# EAGLE design Pressure (EAGLE 9.6.2)
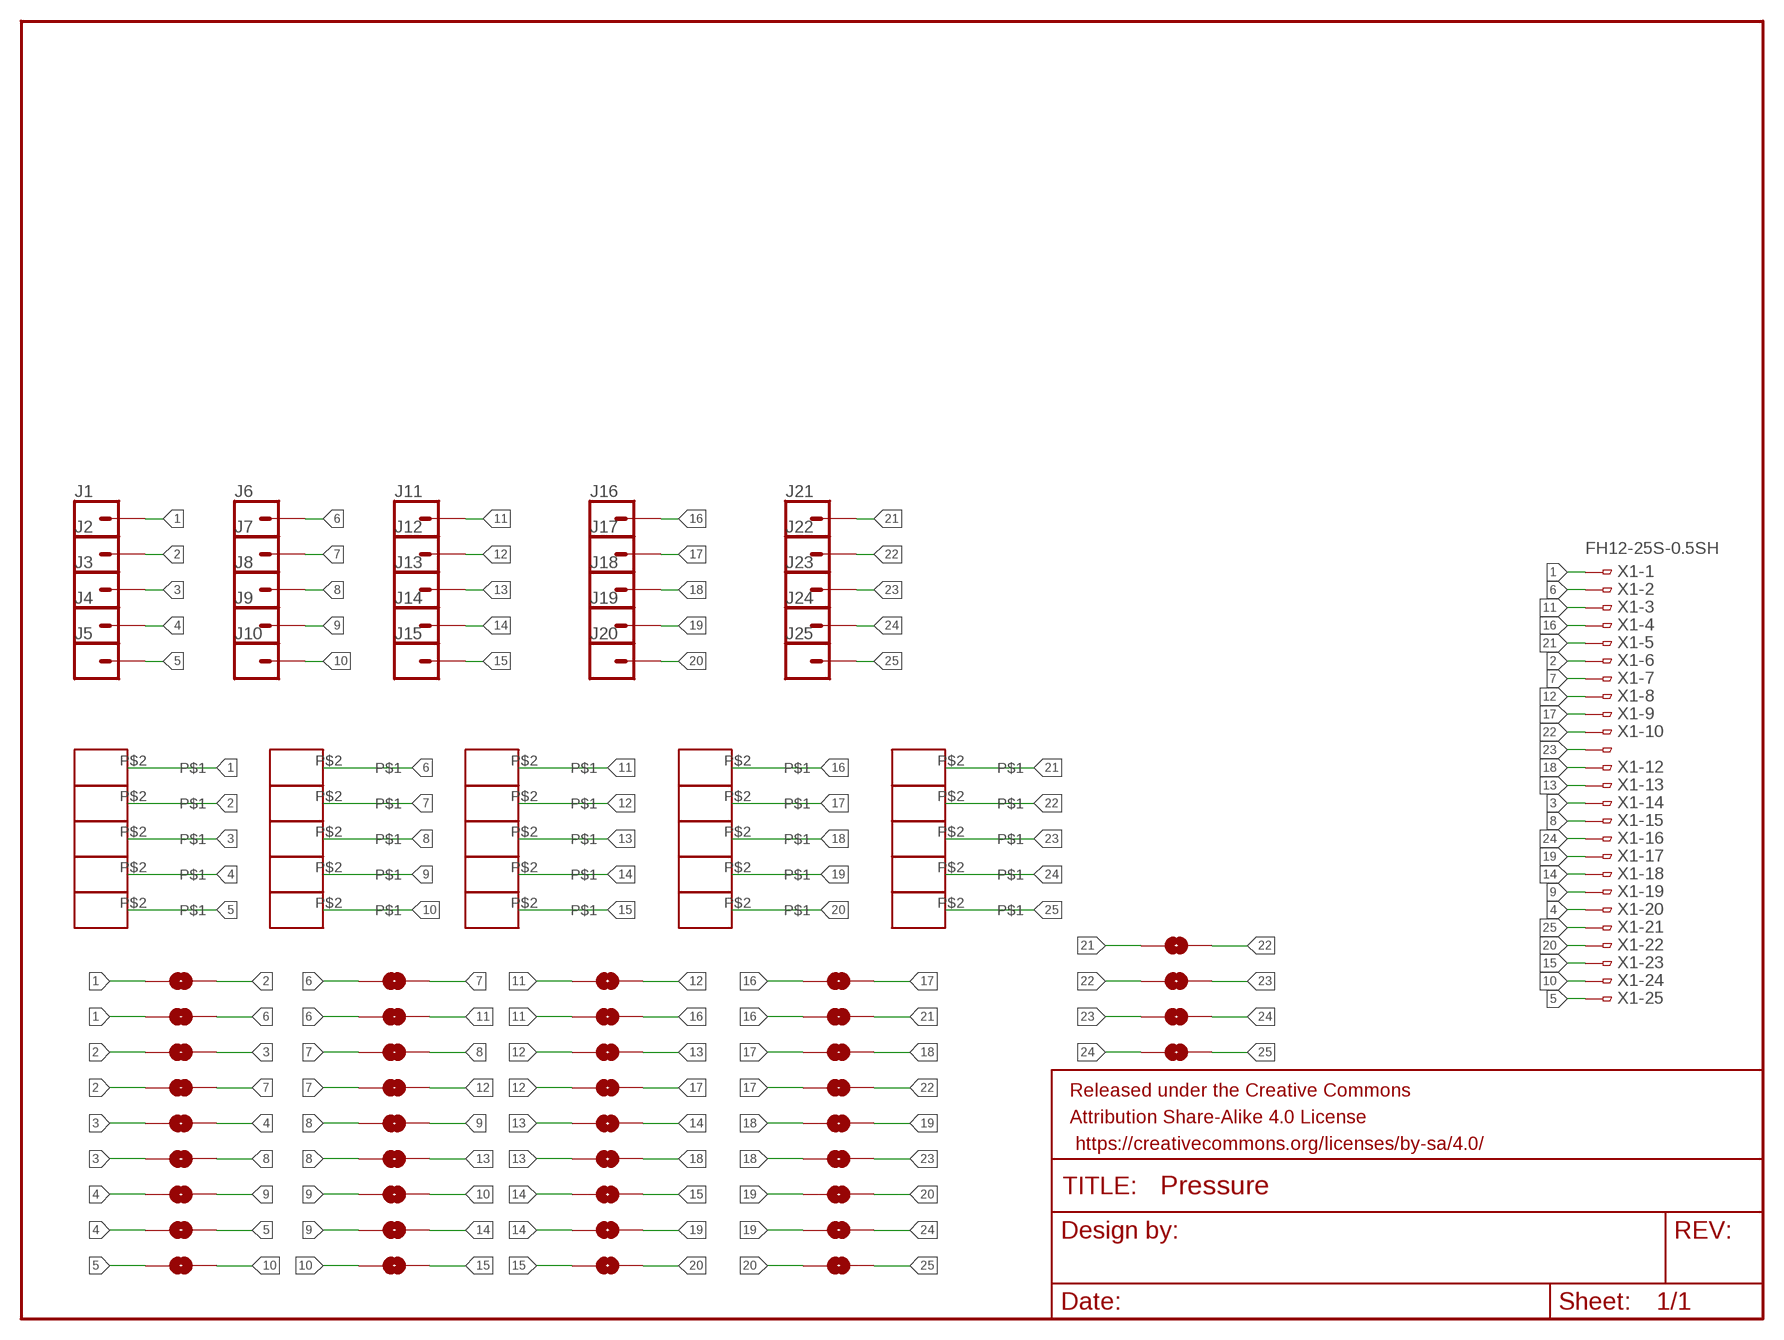
[diagram p0: schematic, sheet 1]

## Parts
FRAME1  FRAME-LETTERNO_PACKAGE  [DUMMY]
J1  CONN_01PTH_NO_SILK_YES_STOP  [1X01_NO_SILK]
J2  CONN_01PTH_NO_SILK_YES_STOP  [1X01_NO_SILK]
J3  CONN_01PTH_NO_SILK_YES_STOP  [1X01_NO_SILK]
J4  CONN_01PTH_NO_SILK_YES_STOP  [1X01_NO_SILK]
J5  CONN_01PTH_NO_SILK_YES_STOP  [1X01_NO_SILK]
J6  CONN_01PTH_NO_SILK_YES_STOP  [1X01_NO_SILK]
J7  CONN_01PTH_NO_SILK_YES_STOP  [1X01_NO_SILK]
J8  CONN_01PTH_NO_SILK_YES_STOP  [1X01_NO_SILK]
J9  CONN_01PTH_NO_SILK_YES_STOP  [1X01_NO_SILK]
J10  CONN_01PTH_NO_SILK_YES_STOP  [1X01_NO_SILK]
J11  CONN_01PTH_NO_SILK_YES_STOP  [1X01_NO_SILK]
J12  CONN_01PTH_NO_SILK_YES_STOP  [1X01_NO_SILK]
J13  CONN_01PTH_NO_SILK_YES_STOP  [1X01_NO_SILK]
J14  CONN_01PTH_NO_SILK_YES_STOP  [1X01_NO_SILK]
J15  CONN_01PTH_NO_SILK_YES_STOP  [1X01_NO_SILK]
J16  CONN_01PTH_NO_SILK_YES_STOP  [1X01_NO_SILK]
J17  CONN_01PTH_NO_SILK_YES_STOP  [1X01_NO_SILK]
J18  CONN_01PTH_NO_SILK_YES_STOP  [1X01_NO_SILK]
J19  CONN_01PTH_NO_SILK_YES_STOP  [1X01_NO_SILK]
J20  CONN_01PTH_NO_SILK_YES_STOP  [1X01_NO_SILK]
J21  CONN_01PTH_NO_SILK_YES_STOP  [1X01_NO_SILK]
J22  CONN_01PTH_NO_SILK_YES_STOP  [1X01_NO_SILK]
J23  CONN_01PTH_NO_SILK_YES_STOP  [1X01_NO_SILK]
J24  CONN_01PTH_NO_SILK_YES_STOP  [1X01_NO_SILK]
J25  CONN_01PTH_NO_SILK_YES_STOP  [1X01_NO_SILK]
JP1  JUMPER-SMT_2_NO_NO-SILK  [SMT-JUMPER_2_NO_NO-SILK]
JP2  JUMPER-SMT_2_NO_NO-SILK  [SMT-JUMPER_2_NO_NO-SILK]
JP3  JUMPER-SMT_2_NO_NO-SILK  [SMT-JUMPER_2_NO_NO-SILK]
JP4  JUMPER-SMT_2_NO_NO-SILK  [SMT-JUMPER_2_NO_NO-SILK]
JP5  JUMPER-SMT_2_NO_NO-SILK  [SMT-JUMPER_2_NO_NO-SILK]
JP6  JUMPER-SMT_2_NO_NO-SILK  [SMT-JUMPER_2_NO_NO-SILK]
JP7  JUMPER-SMT_2_NO_NO-SILK  [SMT-JUMPER_2_NO_NO-SILK]
JP8  JUMPER-SMT_2_NO_NO-SILK  [SMT-JUMPER_2_NO_NO-SILK]
JP9  JUMPER-SMT_2_NO_NO-SILK  [SMT-JUMPER_2_NO_NO-SILK]
JP10  JUMPER-SMT_2_NO_NO-SILK  [SMT-JUMPER_2_NO_NO-SILK]
JP11  JUMPER-SMT_2_NO_NO-SILK  [SMT-JUMPER_2_NO_NO-SILK]
JP12  JUMPER-SMT_2_NO_NO-SILK  [SMT-JUMPER_2_NO_NO-SILK]
JP13  JUMPER-SMT_2_NO_NO-SILK  [SMT-JUMPER_2_NO_NO-SILK]
JP14  JUMPER-SMT_2_NO_NO-SILK  [SMT-JUMPER_2_NO_NO-SILK]
JP15  JUMPER-SMT_2_NO_NO-SILK  [SMT-JUMPER_2_NO_NO-SILK]
JP16  JUMPER-SMT_2_NO_NO-SILK  [SMT-JUMPER_2_NO_NO-SILK]
JP17  JUMPER-SMT_2_NO_NO-SILK  [SMT-JUMPER_2_NO_NO-SILK]
JP18  JUMPER-SMT_2_NO_NO-SILK  [SMT-JUMPER_2_NO_NO-SILK]
JP19  JUMPER-SMT_2_NO_NO-SILK  [SMT-JUMPER_2_NO_NO-SILK]
JP20  JUMPER-SMT_2_NO_NO-SILK  [SMT-JUMPER_2_NO_NO-SILK]
JP21  JUMPER-SMT_2_NO_NO-SILK  [SMT-JUMPER_2_NO_NO-SILK]
JP22  JUMPER-SMT_2_NO_NO-SILK  [SMT-JUMPER_2_NO_NO-SILK]
JP23  JUMPER-SMT_2_NO_NO-SILK  [SMT-JUMPER_2_NO_NO-SILK]
JP24  JUMPER-SMT_2_NO_NO-SILK  [SMT-JUMPER_2_NO_NO-SILK]
JP25  JUMPER-SMT_2_NO_NO-SILK  [SMT-JUMPER_2_NO_NO-SILK]
JP26  JUMPER-SMT_2_NO_NO-SILK  [SMT-JUMPER_2_NO_NO-SILK]
JP27  JUMPER-SMT_2_NO_NO-SILK  [SMT-JUMPER_2_NO_NO-SILK]
JP28  JUMPER-SMT_2_NO_NO-SILK  [SMT-JUMPER_2_NO_NO-SILK]
JP29  JUMPER-SMT_2_NO_NO-SILK  [SMT-JUMPER_2_NO_NO-SILK]
JP30  JUMPER-SMT_2_NO_NO-SILK  [SMT-JUMPER_2_NO_NO-SILK]
JP31  JUMPER-SMT_2_NO_NO-SILK  [SMT-JUMPER_2_NO_NO-SILK]
JP32  JUMPER-SMT_2_NO_NO-SILK  [SMT-JUMPER_2_NO_NO-SILK]
JP33  JUMPER-SMT_2_NO_NO-SILK  [SMT-JUMPER_2_NO_NO-SILK]
JP34  JUMPER-SMT_2_NO_NO-SILK  [SMT-JUMPER_2_NO_NO-SILK]
JP35  JUMPER-SMT_2_NO_NO-SILK  [SMT-JUMPER_2_NO_NO-SILK]
JP36  JUMPER-SMT_2_NO_NO-SILK  [SMT-JUMPER_2_NO_NO-SILK]
JP37  JUMPER-SMT_2_NO_NO-SILK  [SMT-JUMPER_2_NO_NO-SILK]
JP38  JUMPER-SMT_2_NO_NO-SILK  [SMT-JUMPER_2_NO_NO-SILK]
JP39  JUMPER-SMT_2_NO_NO-SILK  [SMT-JUMPER_2_NO_NO-SILK]
JP40  JUMPER-SMT_2_NO_NO-SILK  [SMT-JUMPER_2_NO_NO-SILK]
U$1  250MIL_1X1  [250MIL_1X1]
U$2  250MIL_1X1  [250MIL_1X1]
U$3  250MIL_1X1  [250MIL_1X1]
U$4  250MIL_1X1  [250MIL_1X1]
U$5  250MIL_1X1  [250MIL_1X1]
U$6  250MIL_1X1  [250MIL_1X1]
U$7  250MIL_1X1  [250MIL_1X1]
U$8  250MIL_1X1  [250MIL_1X1]
U$9  250MIL_1X1  [250MIL_1X1]
U$10  250MIL_1X1  [250MIL_1X1]
U$11  250MIL_1X1  [250MIL_1X1]
U$12  250MIL_1X1  [250MIL_1X1]
U$13  250MIL_1X1  [250MIL_1X1]
U$14  250MIL_1X1  [250MIL_1X1]
U$15  250MIL_1X1  [250MIL_1X1]
U$16  250MIL_1X1  [250MIL_1X1]
U$17  250MIL_1X1  [250MIL_1X1]
U$18  250MIL_1X1  [250MIL_1X1]
U$19  250MIL_1X1  [250MIL_1X1]
U$20  250MIL_1X1  [250MIL_1X1]
U$21  250MIL_1X1  [250MIL_1X1]
U$22  250MIL_1X1  [250MIL_1X1]
U$23  250MIL_1X1  [250MIL_1X1]
U$24  250MIL_1X1  [250MIL_1X1]
U$25  250MIL_1X1  [250MIL_1X1]
X1  FH12-25S-0.5SH  [FH12-25S-0.5SH]

## Nets
1: J1.1 JP1.1 JP2.1 U$1.P$2 X1.1
2: J2.1 JP1.2 JP3.1 JP4.1 U$2.P$2 X1.6
3: J3.1 JP3.2 JP5.1 JP6.1 U$3.P$2 X1.14
4: J4.1 JP5.2 JP7.1 JP8.1 U$4.P$2 X1.20
5: J5.1 JP8.2 JP9.1 U$5.P$2 X1.25
6: J6.1 JP2.2 JP10.1 JP11.1 U$6.P$2 X1.2
7: J7.1 JP4.2 JP10.2 JP12.1 JP13.1 U$7.P$2 X1.7
8: J8.1 JP6.2 JP12.2 JP14.1 JP15.1 U$8.P$2 X1.15
9: J9.1 JP7.2 JP14.2 JP16.1 JP17.1 U$9.P$2 X1.19
10: J10.1 JP9.2 JP16.2 JP18.1 U$10.P$2 X1.24
11: J11.1 JP11.2 JP19.1 JP20.1 U$11.P$2 X1.3
12: J12.1 JP13.2 JP19.2 JP21.1 JP22.1 U$12.P$2 X1.8
13: J13.1 JP15.2 JP21.2 JP23.1 JP24.1 U$13.P$2 X1.13
14: J14.1 JP17.2 JP23.2 JP25.1 JP26.1 U$14.P$2 X1.18
15: J15.1 JP18.2 JP25.2 JP27.1 U$15.P$2 X1.23
16: J16.1 JP20.2 JP28.1 JP29.1 U$16.P$2 X1.4
17: J17.1 JP22.2 JP28.2 JP30.1 JP31.1 U$17.P$2 X1.9
18: J18.1 JP24.2 JP30.2 JP32.1 JP33.1 U$18.P$2 X1.12
19: J19.1 JP26.2 JP32.2 JP34.1 JP35.1 U$19.P$2 X1.17
20: J20.1 JP27.2 JP34.2 JP36.1 U$20.P$2 X1.22
21: J21.1 JP29.2 JP37.1 U$21.P$2 X1.5
22: J22.1 JP31.2 JP37.2 JP38.1 U$22.P$2 X1.10
23: J23.1 JP33.2 JP38.2 JP39.1 U$23.P$2 X1.11
24: J24.1 JP35.2 JP39.2 JP40.1 U$24.P$2 X1.16
25: J25.1 JP36.2 JP40.2 U$25.P$2 X1.21

## Library data of the parts
FRAME1 = SparkFun-Aesthetics:FRAME-LETTER: Schematic Frame - Letter Standard 8.5x11 US Letter frame; DESIGNER: Nobody; VERSION: v01
J1-J25 = SparkFun-Connectors:CONN_01: Single connection point. Often used as Generic Header-pin footprint for 0.1 inch spaced/style header connections On any of the 0.1 inch spaced packages, you can populate with these: Break Away Headers - Straight <https://www.sparkfun.com/products/116> (PRT-00116) Break Away Male Headers - Right Angle <https://www.sparkfun.com/products/553> (PRT-00553) Female Headers <https://www.sparkfun.com/products/115> (PRT-00115) Break Away Headers - Machine Pin <https://www.sparkfun.com/products/117> (PRT-00117) Break Away Female Headers - Swiss Machine Pin <https://www.sparkfun.com/products/743> (PRT-00743) This device is also useful as a general connection point to wire up your design to another part of your project. Our various solder wires solder well into these plated through hole pads. Hook-Up Wire - Assortment (Stranded, 22 AWG) <https://www.sparkfun.com/products/11375> (PRT-11375) Hook-Up Wire - Assortment (Solid Core, 22 AWG) <https://www.sparkfun.com/products/11367> (PRT-11367) View the entire wire category on our website here <https://www.sparkfun.com/categories/141> Special notes: SMTSO-256-ET is a "flush mount" nut for a 4-40 screw. We mostly use this on specialty testbeds; it is a nice way to connect hardware to your PCB at an adjustable hieght. Also note, the SNAP packages are for using a snappable style connector. We sell a baggie of snaps and they are also used on two LilyPad designs: Snap Assortment - 30 pack (male and female) <https://www.sparkfun.com/products/11347> (DEV-11347) LilyPad Arduino SimpleSnap <https://www.sparkfun.com/products/10941> (DEV-10941) LilyPad SimpleSnap Protoboard <https://www.sparkfun.com/products/10940> (DEV-10940)
JP1-JP40 = SparkFun-Jumpers:JUMPER-SMT_2_NO: Normally open jumper This jumper has two pads in close proximity to each other. Apply solder to close the connection. Round pads are easier to solder for beginners, but are a lot larger. SparkFun Product that uses the round pads: SparkFun EL Sequencer <https://www.sparkfun.com/products/12781>
U$1-U$25 = connectors:250MIL_1X1
X1 = con-hirose:FH12-25S-0.5S: 0.5mm Pitch Connectors For FPC/FFC Source: Data sheet <http://www.hirose.co.jp/cataloge_hp/e58605370.pdf>; OC_FARNELL: unknown; OC_NEWARK: unknown

## Board
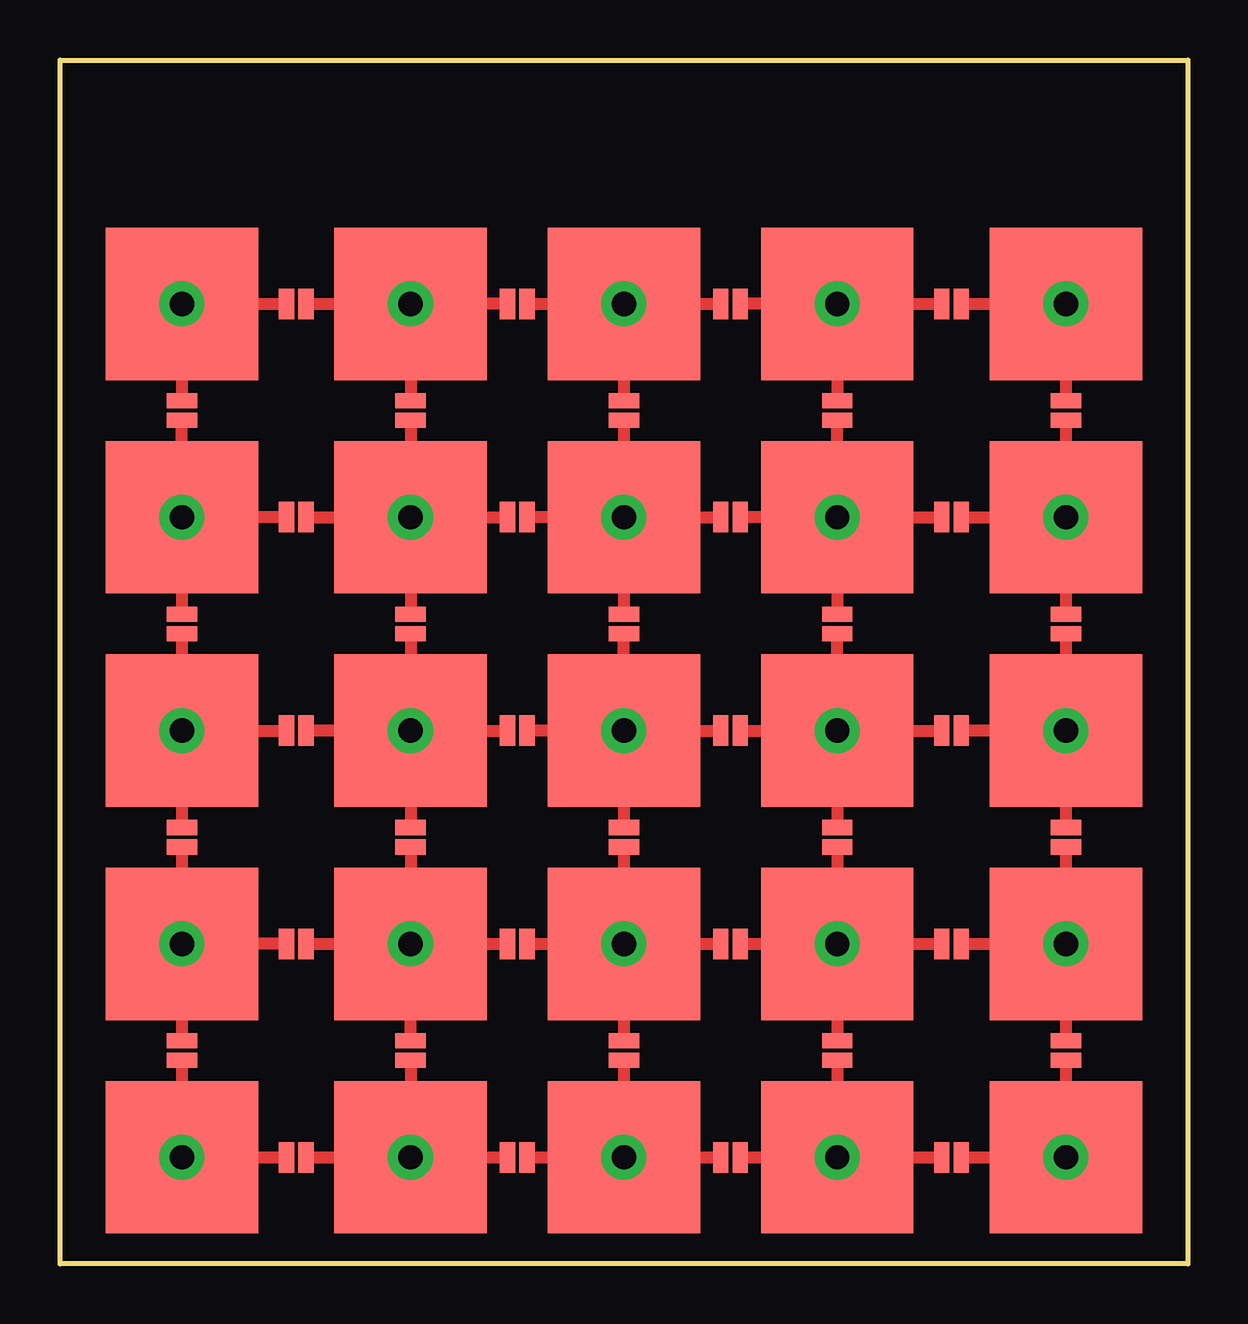
[diagram p1: board, top side]
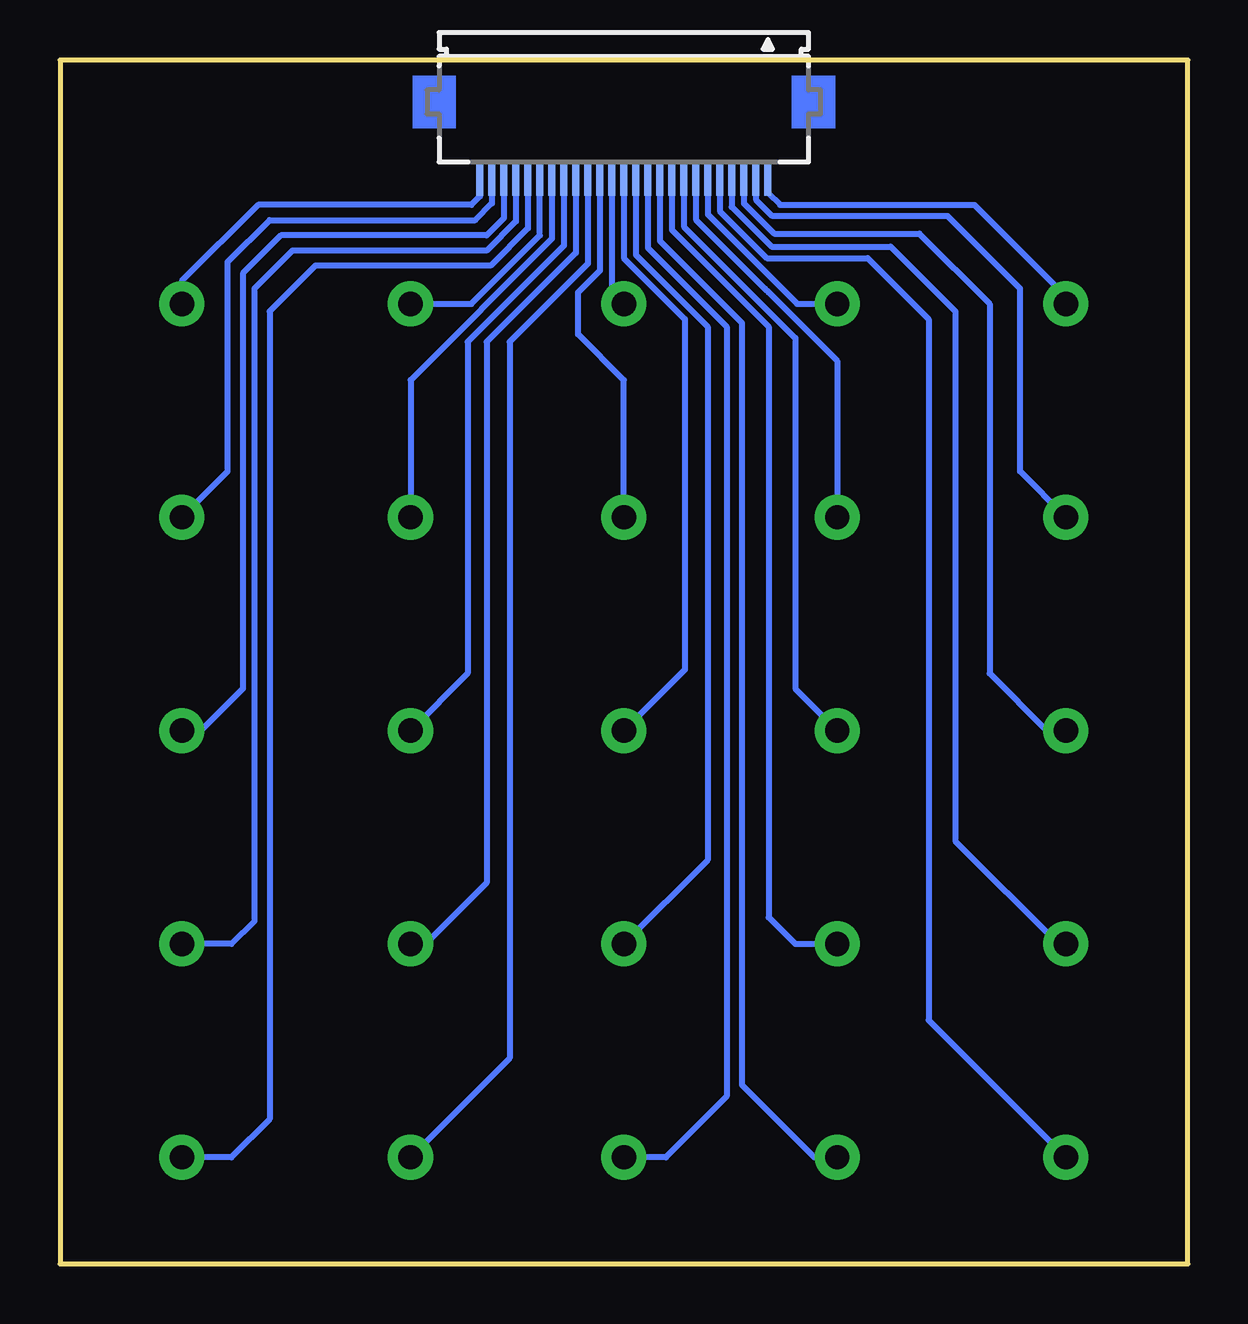
[diagram p2: board, bottom side, seen from below]

Size 46.99 x 50.16 mm. Coordinates in mm from the lower left corner, seen from the top.
Outline: 0,0 0,50.16 46.99,50.16 46.99,0 0,0
Copper layers (1*16): Top 0.035mm / dielectric 1.5mm / Bottom 0.035mm
Design rules "SparkFun-2-layer-TIGHT": minimum track width 7mil, minimum drill 15mil, track to track 7mil, track to pad 7mil, pad to pad 7mil, via to via 7mil, smd to smd 7mil, copper to edge 7mil, drill to drill 7mil, minimum pad ring 7mil, minimum via ring 7mil, stop-mask expansion 4mil, vias tented up to drill 25mil, thermal gap 10mil

### Footprints (pad centres in the part's own frame; a part is rotated, then mirrored left to right if it is on the bottom)
1X01_NO_SILK = drill 1.016 pad 1.88: 1 0,0
SMT-JUMPER_2_NO_NO-SILK = smd 0.635 x 1.27: 1 -0.406,0; 2 0.406,0
250MIL_1X1 = smd 6.35 x 6.35: P$2 0,0
FH12-25S-0.5SH = smd 0.3 x 1.3: 1 -6,3.25; 2 -5.5,3.25; 3 -5,3.25; 4 -4.5,3.25; 5 -4,3.25; 6 -3.5,3.25; 7 -3,3.25; 8 -2.5,3.25; 9 -2,3.25; 10 -1.5,3.25; 11 -1,3.25; 12 -0.5,3.25; 13 0,3.25; 14 0.5,3.25; 15 1,3.25; 16 1.5,3.25; 17 2,3.25; 18 2.5,3.25; 19 3,3.25; 20 3.5,3.25; 21 4,3.25; 22 4.5,3.25; 23 5,3.25; 24 5.5,3.25; 25 6,3.25

### Placement (x,y rotation side)
FRAME1  29.53,-26.04 0 top  (outside the outline)
J1  5.08,40.01 0 top
J2  14.61,40.01 0 top
J3  23.5,40.01 0 top
J4  32.38,40.01 0 top
J5  41.91,40.01 0 top
J6  5.08,31.11 0 top
J7  14.61,31.11 0 top
J8  23.5,31.11 0 top
J9  32.38,31.11 0 top
J10  41.91,31.11 0 top
J11  5.08,22.23 0 top
J12  14.61,22.23 0 top
J13  23.5,22.23 0 top
J14  32.38,22.23 0 top
J15  41.91,22.23 0 top
J16  5.08,13.34 0 top
J17  14.61,13.34 0 top
J18  23.5,13.34 0 top
J19  32.38,13.34 0 top
J20  41.91,13.34 0 top
J21  5.08,4.45 0 top
J22  14.61,4.45 0 top
J23  23.5,4.45 0 top
J24  32.38,4.45 0 top
J25  41.91,4.45 0 top
JP1  9.84,40.01 0 top
JP2  5.08,35.56 270 top
JP3  19.05,40.01 0 top
JP4  14.61,35.56 270 top
JP5  27.94,40.01 0 top
JP6  23.5,35.56 270 top
JP7  32.38,35.56 270 top
JP8  37.15,40.01 0 top
JP9  41.91,35.56 270 top
JP10  9.84,31.11 0 top
JP11  5.08,26.67 270 top
JP12  19.05,31.11 0 top
JP13  14.61,26.67 270 top
JP14  27.94,31.11 0 top
JP15  23.5,26.67 270 top
JP16  37.15,31.11 0 top
JP17  32.38,26.67 270 top
JP18  41.91,26.67 270 top
JP19  9.84,22.23 0 top
JP20  5.08,17.78 270 top
JP21  19.05,22.23 0 top
JP22  14.61,17.78 270 top
JP23  27.94,22.23 0 top
JP24  23.5,17.78 270 top
JP25  37.15,22.23 0 top
JP26  32.38,17.78 270 top
JP27  41.91,17.78 270 top
JP28  9.84,13.34 0 top
JP29  5.08,8.89 270 top
JP30  19.05,13.34 0 top
JP31  14.61,8.89 270 top
JP32  27.94,13.34 0 top
JP33  23.5,8.89 270 top
JP34  37.15,13.34 0 top
JP35  32.38,8.89 270 top
JP36  41.91,8.89 270 top
JP37  9.84,4.45 0 top
JP38  19.05,4.45 0 top
JP39  27.94,4.45 0 top
JP40  37.15,4.45 0 top
U$1  5.08,40.01 0 top
U$2  14.61,40.01 90 top
U$3  23.5,40.01 270 top
U$4  32.38,40.01 270 top
U$5  41.91,40.01 270 top
U$6  5.08,31.11 90 top
U$7  14.61,31.11 90 top
U$8  23.5,31.11 270 top
U$9  32.38,31.11 270 top
U$10  41.91,31.11 90 top
U$11  5.08,22.23 90 top
U$12  14.61,22.23 90 top
U$13  23.5,22.23 90 top
U$14  32.38,22.23 90 top
U$15  41.91,22.23 90 top
U$16  5.08,13.34 90 top
U$17  14.61,13.34 90 top
U$18  23.5,13.34 90 top
U$19  32.38,13.34 90 top
U$20  41.91,13.34 90 top
U$21  5.08,4.45 90 top
U$22  14.61,4.45 90 top
U$23  23.5,4.45 90 top
U$24  32.38,4.45 90 top
U$25  41.91,4.45 90 top
X1  23.5,48.42 180 bottom

### Tracks (layer width: path | path; a pad name or v marks a point on that pad's centre or on a via)
1
  Top 0.508: JP1.1 J1.1 JP2.1
  Bottom 0.254: X1.1 17.5,44.64 16.99,44.13 8.89,44.13 5.08,40.32 J1.1
2
  Top 0.508: JP1.2 J2.1 | JP3.1 J2.1 | J2.1 JP4.1
  Bottom 0.254: X1.6 20,43.73 16.27,40.01 J2.1
3
  Top 0.508: JP3.2 J3.1 | J3.1 JP5.1 | J3.1 JP6.1
  Bottom 0.254: X1.14 24,40.51 J3.1
4
  Top 0.508: J4.1 JP7.1 | J4.1 JP8.1 | J4.1 JP5.2
  Bottom 0.254: X1.20 27,42.85 29.85,40.01 J4.1
5
  Top 0.508: JP8.2 J5.1 JP9.1
  Bottom 0.254: X1.25 29.5,44.48 29.85,44.13 38.73,44.13 41.91,40.96 J5.1
6
  Top 0.508: JP10.1 J6.1 | J6.1 JP2.2 | J6.1 JP11.1
  Bottom 0.254: X1.2 18,44.35 17.3,43.66 10,43.66 6.98,40.64 6.98,33.02 J6.1
7
  Top 0.508: JP4.2 J7.1 | JP10.2 J7.1 | J7.1 JP12.1 | J7.1 JP13.1
  Bottom 0.254: X1.7 20.5,43.51 17.62,40.64 17.46,40.48 14.61,37.62 J7.1
8
  Top 0.508: JP6.2 J8.1 | J8.1 JP14.1 | J8.1 JP15.1 | J8.1 JP12.2
  Bottom 0.254: X1.15 24.5,41.39 25.16,40.72 25.24,40.64 25.4,40.48 25.4,38.73 23.5,36.83 J8.1
9
  Top 0.508: J9.1 JP7.2 | J9.1 JP16.1 | J9.1 JP17.1 | J9.1 JP14.2
  Bottom 0.254: X1.19 26.5,42.72 32.38,36.83 J9.1
10
  Top 0.508: JP16.2 J10.1 | J10.1 JP18.1 | JP9.2 J10.1
  Bottom 0.254: X1.24 29,44.19 29.69,43.5 38.26,43.5 40,41.75 40,33.02 J10.1
11
  Top 0.508: JP11.2 J11.1 | J11.1 JP20.1 | J11.1 JP19.1
  Bottom 0.254: X1.3 18.5,44.19 17.23,42.93 11.18,42.93 8.26,40.01 8.26,24.61 5.87,22.23 J11.1
12
  Top 0.508: JP13.2 J12.1 | J12.1 JP19.2 | J12.1 JP21.1 | J12.1 JP22.1
  Bottom 0.254: X1.8 21,43.22 16.35,38.58 16.35,23.97 J12.1
13
  Top 0.508: J13.1 JP23.1 | J13.1 JP15.2 | J13.1 JP21.2 | J13.1 JP24.1
  Bottom 0.254: X1.13 23.5,41.91 20.96,39.37 20.96,24.77 J13.1
14
  Top 0.508: JP23.2 J14.1 | J14.1 JP17.2 | J14.1 JP25.1 | J14.1 JP26.1
  Bottom 0.254: X1.18 26,42.43 30,38.42 30,24.61 J14.1
15
  Top 0.508: JP18.2 J15.1 | J15.1 JP25.2 | J15.1 JP27.1
  Bottom 0.254: X1.23 28.5,43.58 29.21,42.86 37.78,42.86 39.37,41.27 39.37,23.97 41.12,22.23 J15.1
16
  Top 0.508: JP28.1 J16.1 | JP20.2 J16.1 | J16.1 JP29.1
  Bottom 0.254: X1.4 19,44.05 17.34,42.39 12.38,42.39 9.68,39.69 9.68,17.62 5.4,13.34 J16.1
17
  Top 0.508: JP31.1 J17.1 | J17.1 JP30.1 | JP22.2 J17.1 | JP28.2 J17.1
  Bottom 0.254: X1.9 21.5,43.09 18.34,39.93 18.26,39.85 17.46,39.05 17.46,14.45 16.35,13.34 J17.1
18
  Top 0.508: JP24.2 J18.1 | J18.1 JP32.1 | JP30.2 J18.1 | J18.1 JP33.1
  Bottom 0.254: X1.12 23,42.05 20,39.05 20,16.83 J18.1
19
  Top 0.508: J19.1 JP34.1 | JP26.2 J19.1 | JP32.2 J19.1 | J19.1 JP35.1
  Bottom 0.254: X1.17 25.5,42.13 29.21,38.42 29.21,15.88 31.75,13.34 J19.1
20
  Top 0.508: JP27.2 J20.1 | JP34.2 J20.1 | J20.1 JP36.1
  Bottom 0.254: X1.22 28,43.44 29.21,42.23 37.31,42.23 38.89,40.64 38.89,14.29 39.85,13.34 J20.1
21
  Top 0.508: JP29.2 J21.1 JP37.1
  Bottom 0.254: X1.5 19.5,43.86 17.54,41.91 13.33,41.91 10.79,39.37 10.79,10.16 J21.1
22
  Top 0.508: JP31.2 J22.1 | J22.1 JP38.1 | JP37.2 J22.1
  Bottom 0.254: X1.10 22,42.63 18.57,39.21 18.57,7.46 15.56,4.45 J22.1
23
  Top 0.508: JP33.2 J23.1 | JP38.2 J23.1 | J23.1 JP39.1
  Bottom 0.254: X1.11 22.5,42.34 19.21,39.05 19.21,6.99 21.75,4.45 J23.1
24
  Top 0.508: JP35.2 J24.1 | JP39.2 J24.1 | J24.1 JP40.1
  Bottom 0.254: X1.16 25,41.68 28.26,38.42 28.26,8.57 J24.1
25
  Top 0.508: JP36.2 J25.1 JP40.2
  Bottom 0.254: X1.21 27.5,43.15 29.05,41.59 36.35,41.59 38.26,39.69 38.26,6.03 39.85,4.45 J25.1